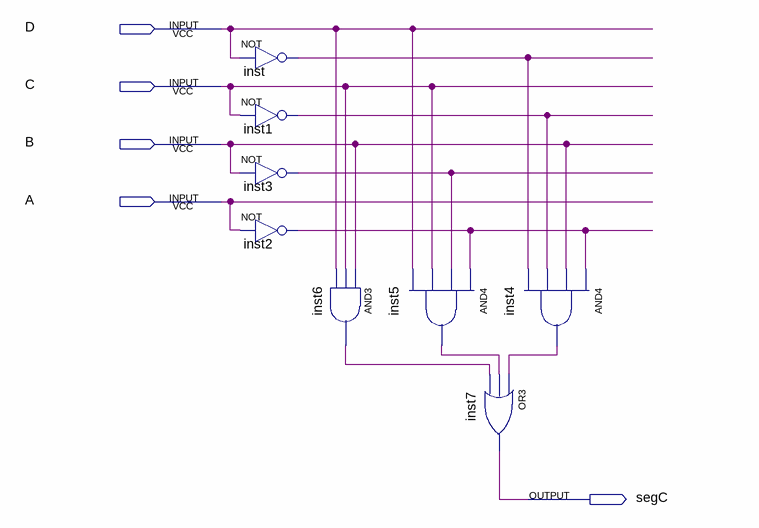
[diagram p0: schematic sheet]
// Quartus schematic segC.bdf as structural Verilog: 8 symbols, 5 pins
module segC (
  input  D,
  input  C,
  input  B,
  input  A,
  output segC
);

  wire inst1_out, inst2_out, inst3_out, inst4_out, inst5_out, inst6_out, inst_out;

  not inst (inst_out, D);
  not inst1 (inst1_out, C);
  not inst3 (inst3_out, B);
  not inst2 (inst2_out, A);
  and inst6 (inst6_out, B, C, D);
  and inst5 (inst5_out, inst2_out, inst3_out, C, D);
  or inst7 (segC, inst4_out, inst5_out, inst6_out);
  and inst4 (inst4_out, inst2_out, B, inst1_out, inst_out);
endmodule
